# EAGLE schematic USB Host (EAGLE 6.5.0)
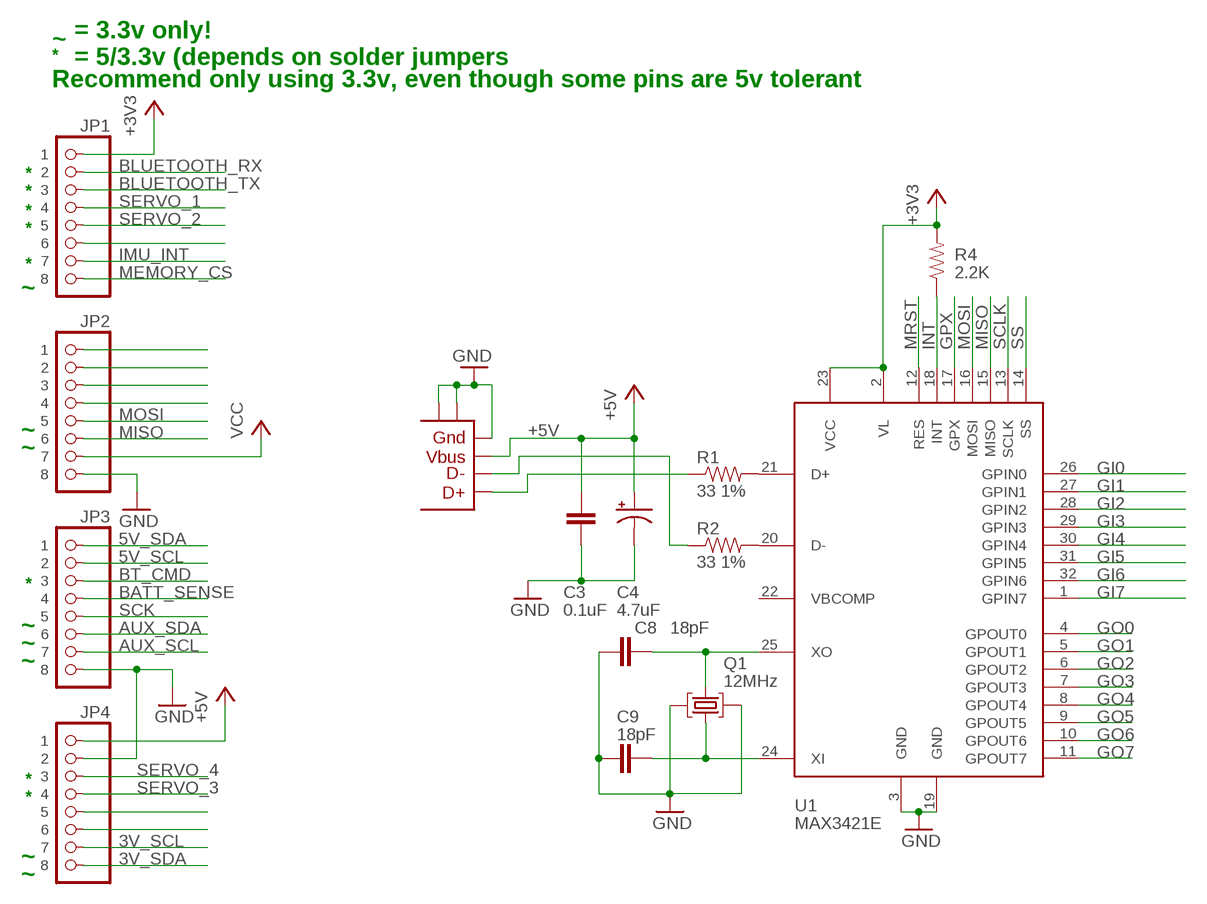
[diagram p0: schematic, sheet 1]

## Parts
C3  0.1uF  CAP0603  [0603]
C4  4.7uF  CAP_POL1206  [EIA3216]
C8  18pF  CAP0603  [0603]
C9  18pF  CAP0603  [0603]
JP1  8-PIN_HEADER  [8-PIN_RECEPTACLE_LOCK_NO-SS]
JP2  8-PIN_HEADER  [8-PIN_RECEPTACLE_LOCK_NO-SS]
JP3  8-PIN_HEADER  [8-PIN_RECEPTACLE_LOCK_NO-SS]
JP4  8-PIN_HEADER  [8-PIN_RECEPTACLE_LOCK_NO-SS]
Q1  12MHz  CRYSTAL_SH  [CRYSTAL-SMD-5X3]
R1  33 1%  RESISTOR0603  [0603]
R2  33 1%  RESISTOR0603  [0603]
R4  2.2K  RESISTOR0603  [0603]
U1  MAX3421E  [TQFP32_8MIL]
U$1  USB_SOCKETTYPE-A  [USB_SOCKET]

## Nets
3V_SCL: JP4.P$7
3V_SDA: JP4.P$8
5V_SCL: JP3.P$2
5V_SDA: JP3.P$1
+3V3: JP1.P$1 R4.2 U1.2(VL) U1.23(VCC)
+5V: C3.1 C4.A(+) JP4.P$1 U$1.P$1(VBUS)
AUX_SCL: JP3.P$7
AUX_SDA: JP3.P$6
BATT_SENSE: JP3.P$4
BLUETOOTH_RX: JP1.P$2
BLUETOOTH_TX: JP1.P$3
BT_CMD: JP3.P$3
GI0: U1.26(GPIN0)
GI1: U1.27(GPIN1)
GI2: U1.28(GPIN2)
GI3: U1.29(GPIN3)
GI4: U1.30(GPIN4)
GI5: U1.31(GPIN5)
GI6: U1.32(GPIN6)
GI7: U1.1(GPIN7)
GND: C3.2 C4.C(-) C8.1 C9.1 JP2.P$8 JP3.P$8 JP4.P$2 Q1.2 Q1.4 U1.3(GND) U1.19(GND) U$1.P$4(GND) U$1.P$5 U$1.P$6
GO0: U1.4(GPOUT0)
GO1: U1.5(GPOUT1)
GO2: U1.6(GPOUT2)
GO3: U1.7(GPOUT3)
GO4: U1.8(GPOUT4)
GO5: U1.9(GPOUT5)
GO6: U1.10(GPOUT6)
GO7: U1.11(GPOUT7)
GPX: U1.17(GPX)
IMU_INT: JP1.P$7
INT: R4.1 U1.18(INT)
MEMORY_CS: JP1.P$8
MISO: JP2.P$6 U1.15(MISO)
MOSI: JP2.P$5 U1.16(MOSI)
MRST: U1.12(RES)
N$1: R1.1 U$1.P$3(D+)
N$4: JP2.P$4
N$5: JP2.P$3
N$6: JP2.P$2
N$7: JP2.P$1
N$8: R1.2 U1.21(D+)
N$10: JP1.P$6
N$16: R2.2 U1.20(D-)
N$26: JP4.P$5
N$27: JP4.P$6
N$40: C8.2 Q1.3 U1.25(XO)
N$41: C9.2 Q1.1 U1.24(XI)
N$54: R2.1 U$1.P$2(D-)
SCK: JP3.P$5
SCLK: U1.13(SCLK)
SERVO_1: JP1.P$4
SERVO_2: JP1.P$5
SERVO_3: JP4.P$4
SERVO_4: JP4.P$3
SS: U1.14(SS)
VCC: JP2.P$7
Unconnected: U1.22(VBCOMP)

## Notes on the sheet
- = 3.3v only!
- ~
- * | = 5/3.3v (depends on solder jumpers
- Recommend only using 3.3v, even though some pins are 5v tolerant
- *
- *
- *
- *
- *
- ~
- ~
- ~
- *
- ~
- ~
- ~
- *
- *
- ~
- ~

## Library data of the parts
C3 C8 C9 = CH_passive:CAP: Capacitor Standard 0603 ceramic capacitor, and 0.1" leaded capacitor.
C4 = CH_passive:CAP_POL: Capacitor Polarized These are standard SMD and PTH capacitors. Normally 10uF, 47uF, and 100uF in electrolytic and tantalum varieties. Always verify the external diameter of the through hole cap, it varies with capacity, voltage, and manufacturer. The EIA devices should be standard.
JP1-JP4 = My Parts:8-PIN_HEADER
Q1 = CH_passive:CRYSTAL_SH
R1 R2 R4 = CH_passive:RESISTOR: Resistor Basic schematic elements and footprints for 0603, 1206, and PTH 1/10th watt (small) resistors.
U1 = CH_Maxim:MAX3421E
U$1 = My Parts:USB_SOCKET; PART#: USB-A1HSW6